# EAGLE schematic 1 (EAGLE 9.6.2)
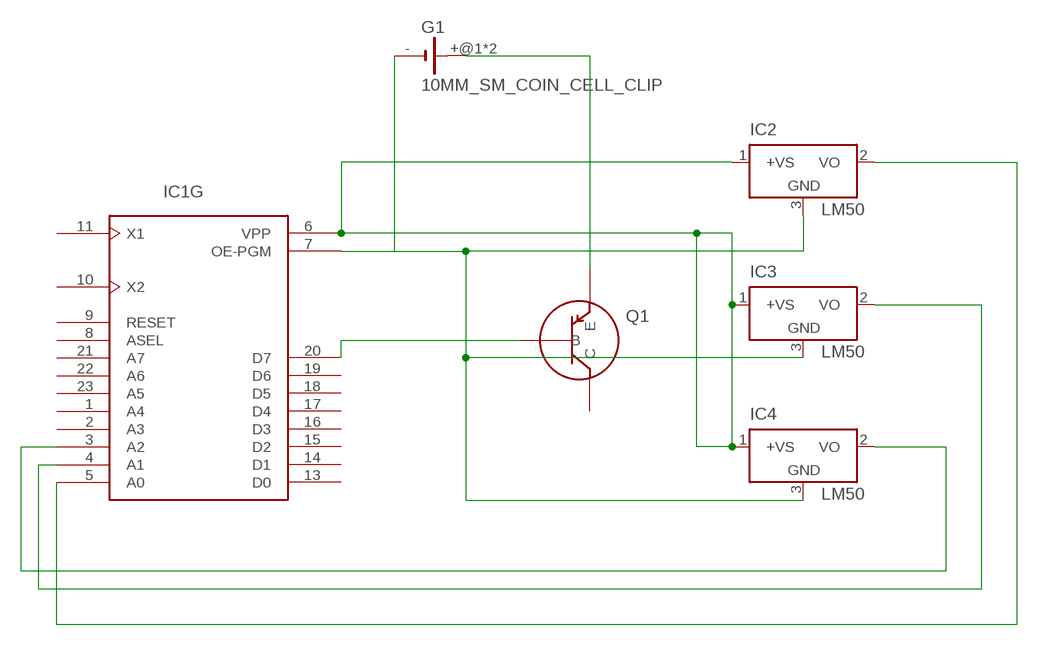
[diagram p0: schematic, sheet 1]

## Parts
G1  10MM_SM_COIN_CELL_CLIP  [10MM_SM_COIN_CELL_CLIP]
IC1  87C748  [DIP24SKI]
IC2  LM50  [SOT23]
IC3  LM50  [SOT23]
IC4  LM50  [SOT23]
Q1  BJT_PNP  (no package)

## Nets
N$1: IC1.20(G:D7) Q1.B
N$2: IC1.5(G:A0) IC2.2(VO)
N$3: IC1.4(G:A1) IC3.2(VO)
N$4: IC1.3(G:A2) IC4.2(VO)
N$5: G1.+@1(+) G1.+@2(+) Q1.E
N$6: IC1.6(G:VPP) IC2.1(+VS) IC3.1(+VS) IC4.1(+VS)
N$7: G1.- IC1.7(G:OE-PGM) IC2.3(GND) IC3.3(GND) IC4.3(GND)
Unconnected: IC1.1(G:A4) IC1.2(G:A3) IC1.8(G:ASEL) IC1.9(G:RESET) IC1.10(G:X2) IC1.11(G:X1) IC1.13(G:D0) IC1.14(G:D1) IC1.15(G:D2) IC1.16(G:D3) IC1.17(G:D4) IC1.18(G:D5) IC1.19(G:D6) IC1.21(G:A7) IC1.22(G:A6) IC1.23(G:A5) Q1.C

## Power pins joined to a net without a drawn wire
GND: IC1.12(P:GND)
VCC: IC1.24(P:VCC)

## Library data of the parts
G1 = battery:10MM_SM_COIN_CELL_CLIP: Battery cell clip for CR927 Source: KEYSTONE ELECTRONICS CORP. www.keyelco.com, ASTORIA, N.Y. 11105-2017 PART ANME 10mm SM COIN CELl CLIP DWG NO. 3030
IC1 = micro-philips:87C748: 8051 -comabtible 8bit Microcontroller; OC_FARNELL: unknown; OC_NEWARK: unknown
IC2-IC4 = linear:LM50: SOT-23 Single-Supply Centigrade Temperature Sensor Vout = (10mV/°C x Temp °C) +5mmmV Source: http://cache.national.com/ds/LM/LM50.pdf
Q1 = ngspice-simulation:BJT_PNP: Bipolar PNP Transistor